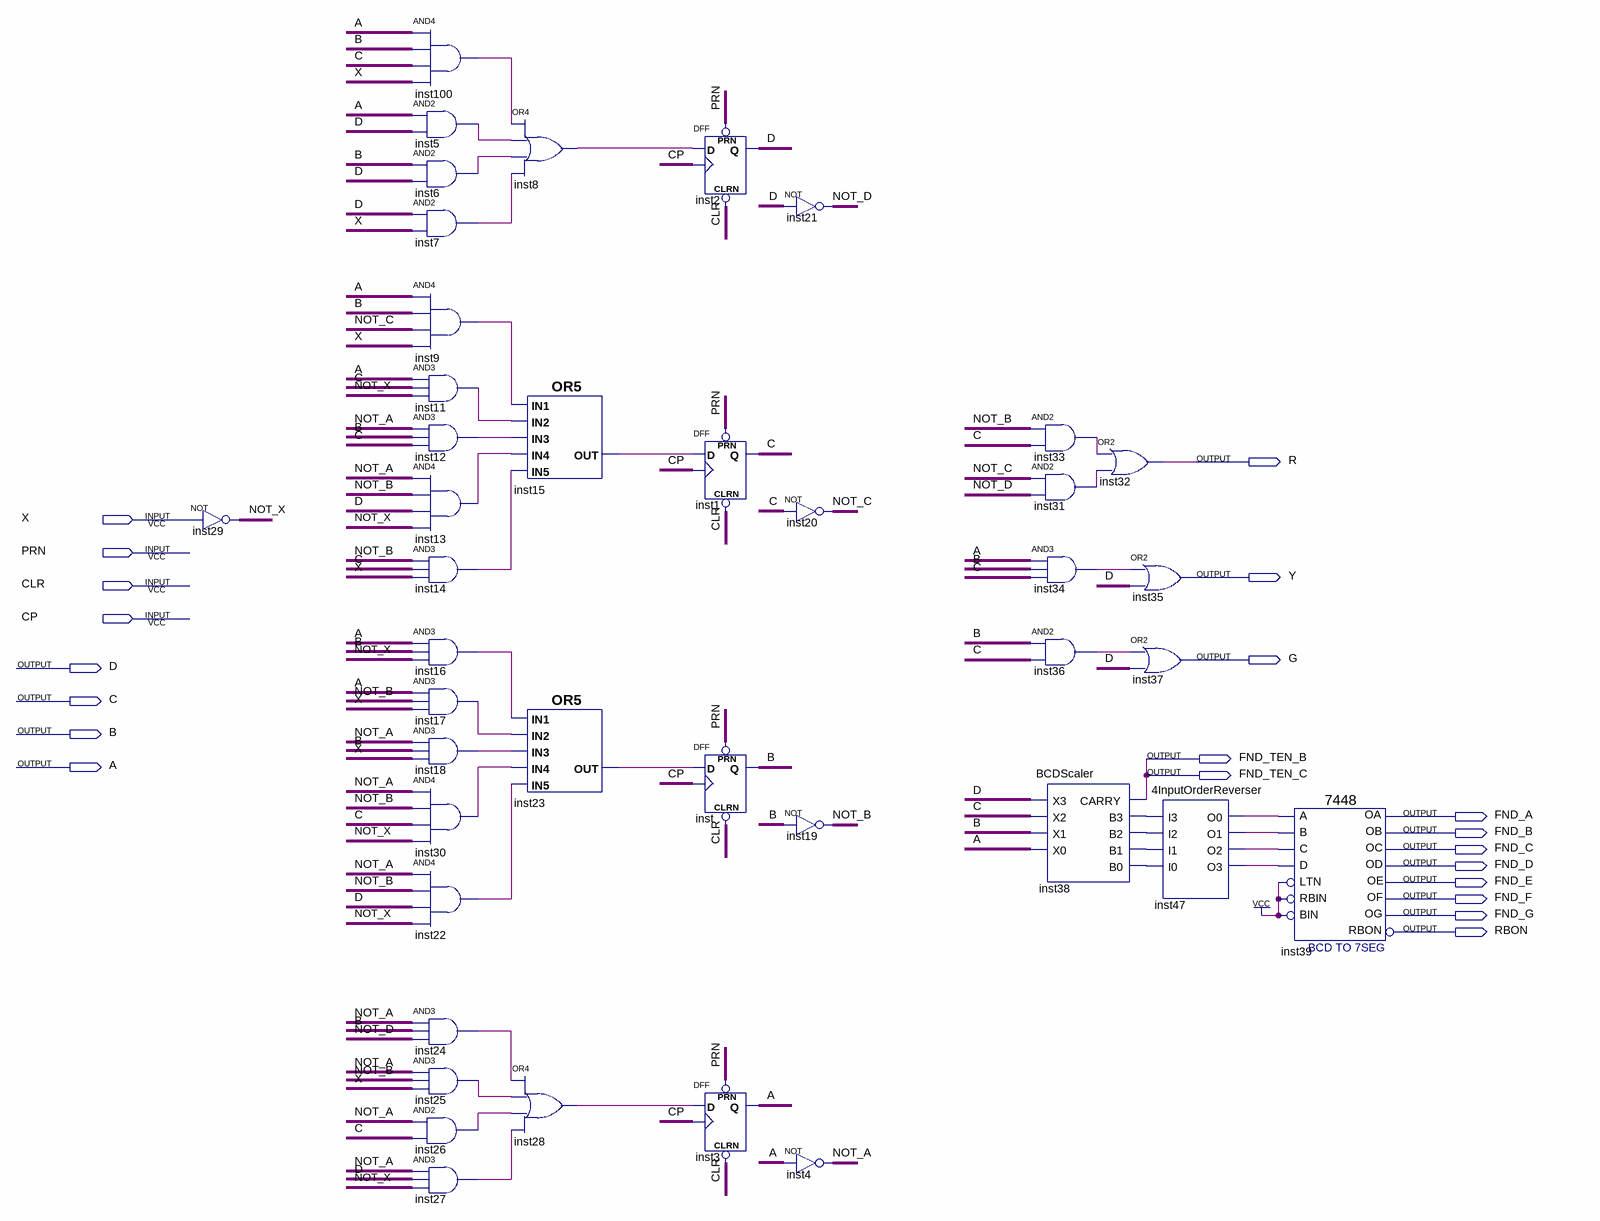
[diagram p0: schematic sheet]
// Quartus schematic Project.bdf as structural Verilog: 41 symbols, 21 pins
module Project (
  input  X,
  input  PRN,
  input  CLR,
  input  CP,
  output R,
  output Y,
  output G,
  output D,
  output C,
  output B,
  output FND_TEN_B,
  output A,
  output FND_TEN_C,
  output FND_A,
  output FND_B,
  output FND_C,
  output FND_D,
  output FND_E,
  output FND_F,
  output FND_G,
  output RBON
);

  wire inst5_out, inst6_out, inst7_out, inst8_out, inst9_out, inst11_out, inst12_out, inst13_out, inst14_out,
       inst15_out, inst16_out, inst17_out, inst18_out, inst22_out, inst23_out, inst24_out, inst25_out,
       inst26_out, inst27_out, inst28_out, inst30_out, inst31_out, inst33_out, inst34_out, inst36_out,
       inst38_b0, inst38_b1, inst38_b2, inst38_b3, inst47_o0, inst47_o1, inst47_o2, inst47_o3, inst100_out,
       NOT_A, NOT_B, NOT_C, NOT_D, NOT_X;

  not inst29 (NOT_X, X);
  and inst100 (inst100_out, A, B, C, X);
  and inst5 (inst5_out, A, D);
  and inst6 (inst6_out, B, D);
  and inst7 (inst7_out, D, X);
  and inst9 (inst9_out, A, B, NOT_C, X);
  and inst11 (inst11_out, A, C, NOT_X);
  and inst12 (inst12_out, NOT_A, B, C);
  and inst13 (inst13_out, NOT_A, NOT_B, D, NOT_X);
  and inst14 (inst14_out, NOT_B, C, X);
  and inst16 (inst16_out, A, B, NOT_X);
  and inst17 (inst17_out, A, NOT_B, X);
  and inst18 (inst18_out, NOT_A, B, X);
  and inst30 (inst30_out, NOT_A, NOT_B, C, NOT_X);
  and inst22 (inst22_out, NOT_A, NOT_B, D, NOT_X);
  and inst24 (inst24_out, NOT_A, B, NOT_D);
  and inst25 (inst25_out, NOT_A, NOT_B, X);
  and inst26 (inst26_out, NOT_A, C);
  and inst27 (inst27_out, NOT_A, D, NOT_X);
  or inst8 (inst8_out, inst100_out, inst5_out, inst6_out, inst7_out);
  or inst15 (inst15_out, inst9_out, inst11_out, inst12_out, inst13_out, inst14_out);
  or inst23 (inst23_out, inst16_out, inst17_out, inst18_out, inst30_out, inst22_out);
  or inst28 (inst28_out, inst24_out, inst25_out, inst26_out, inst27_out);
  DFF inst2 (.CLRN(CLR), .CLK(CP), .D(inst8_out), .PRN(PRN), .Q(D));
  DFF inst1 (.CLRN(CLR), .CLK(CP), .D(inst15_out), .PRN(PRN), .Q(C));
  DFF inst (.CLRN(CLR), .CLK(CP), .D(inst23_out), .PRN(PRN), .Q(B));
  DFF inst3 (.CLRN(CLR), .CLK(CP), .D(inst28_out), .PRN(PRN), .Q(A));
  not inst21 (NOT_D, D);
  not inst20 (NOT_C, C);
  not inst19 (NOT_B, B);
  not inst4 (NOT_A, A);
  and inst33 (inst33_out, NOT_B, C);
  and inst31 (inst31_out, NOT_C, NOT_D);
  and inst34 (inst34_out, A, B, C);
  and inst36 (inst36_out, B, C);
  BCDScaler inst38 (
    .X3(D), .X2(C), .X1(B), .X0(A), .CARRY(FND_TEN_B), .B3(inst38_b3), .B2(inst38_b2), .B1(inst38_b1),
    .B0(inst38_b0));
  or inst32 (R, inst33_out, inst31_out);
  or inst35 (Y, inst34_out, D);
  or inst37 (G, inst36_out, D);
  \4InputOrderReverser  inst47 (
    .I3(inst38_b3), .I2(inst38_b2), .I1(inst38_b1), .I0(inst38_b0), .O0(inst47_o0), .O1(inst47_o1),
    .O2(inst47_o2), .O3(inst47_o3));
  \7448  inst39 (
    .A(inst47_o0), .C(inst47_o2), .D(inst47_o3), .B(inst47_o1), .RBIN(1'b1), .BIN(1'b1), .LTN(1'b1),
    .OC(FND_C), .OE(FND_E), .OD(FND_D), .OF(FND_F), .OG(FND_G), .OB(FND_B), .OA(FND_A), .RBON(RBON));

  assign FND_TEN_C = FND_TEN_B;
endmodule
